# Altium schematic sheet A3210.SchDoc
size A4
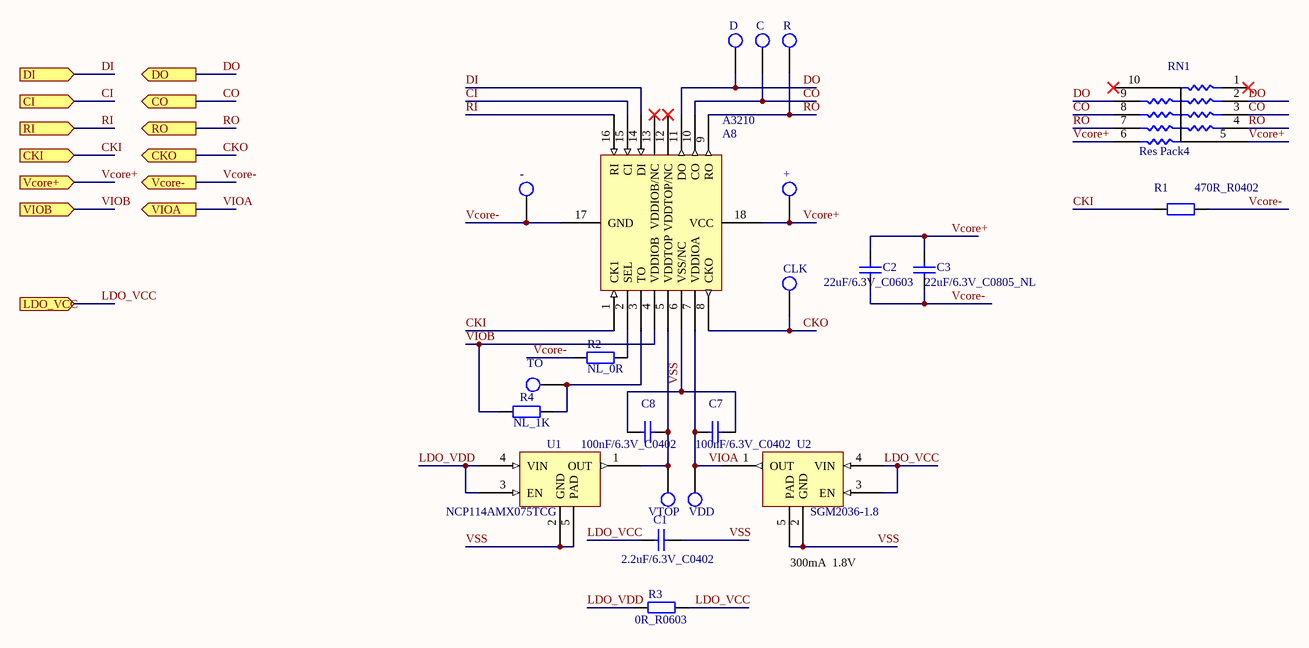
[diagram p0: A3210.SchDoc]

## Parts
+  Socket  [tp28]  (value not drawn)
-  Socket  [tp28]  (value not drawn)
A8  A3210  [DFN-A8-007]
C  Socket  [tp28]  (value not drawn)
C1  value 2.2uF/6.3V_C0402  [c0402]  (hidden comment: Cap)
C2  value 22uF/6.3V_C0603  [c0603]  (hidden comment: Cap)
C3  value 22uF/6.3V_C0805_NL  [c0805]  (hidden comment: Cap)
C7  value 100nF/6.3V_C0402  [c0402]  (hidden comment: Cap)
C8  value 100nF/6.3V_C0402  [c0402]  (hidden comment: Cap)
CLK  Socket  [tp28]  (value not drawn)
D  Socket  [tp28]  (value not drawn)
R  Socket  [tp28]  (value not drawn)
R1  value 470R_R0402  [r0402]  (hidden comment: Res2)
R2  value NL_0R  [R0603]  (hidden comment: Res2)
R3  value 0R_R0603  [R0603]  (hidden comment: Res2)
R4  value NL_1K  [R0402]  (hidden comment: Res2)
RN1  Res Pack4  [RN0402-8-a]
TO  Socket  [tp28]  (value not drawn)
U1  NCP114AMX075TCG  [DFN4-065-0101-006-N]
U2  SGM2036-1.8  [DFN4-065-0101-006-N]
VDD  Socket  [tp28]  (value not drawn)
VTOP  Socket  [tp28]  (value not drawn)

## Ports
CI (in), CKI (in), CKO (out), CO (out), DI (in), DO (out), LDO_VCC (in), RI (in), RO (out), Vcore+ (in), Vcore- (out), VIOA (out), VIOB (in)

## Nets
CI: A8.15(CI) ; port CI
CKI: A8.1(CK1) R1.2 ; port CKI
CKO: A8.8(CKO) CLK.1 ; port CKO
CO: A8.10(CO) C.1 RN1.3 RN1.8 ; port CO
DI: A8.14(DI) ; port DI
DO: A8.11(DO) D.1 RN1.2 RN1.9 ; port DO
LDO_VCC: C1.1 R3.1 U2.3(EN) U2.4(VIN) ; port LDO_VCC
LDO_VDD: R3.2 U1.3(EN) U1.4(VIN)
RI: A8.16(RI) ; port RI
RO: A8.9(RO) R.1 RN1.4 RN1.7 ; port RO
Vcore+: +.1 A8.18(VCC) C2.1 C3.1 RN1.5 RN1.6 ; port Vcore+
Vcore-: -.1 A8.17(GND) C2.2 C3.2 R1.1 R2.2 ; port Vcore-
VIOA: A8.7(VDDIOA) C7.1 U2.1(OUT) VDD.1 ; port VIOA
VIOB: A8.4(VDDIOB) R4.1 ; port VIOB
VSS: A8.6(VSS/NC) C1.2 C7.2 C8.1 U1.2(GND) U1.5(PAD) U2.2(GND) U2.5(PAD)
NetA8_2: A8.2(SEL) R2.1
NetA8_3: A8.3(TO) R4.2 TO.1
NetA8_5: A8.5(VDDTOP) C8.2 U1.1(OUT) VTOP.1

Not connected (* = marked no-connect by the designer): A8 12(VDDTOP/NC)* 13(VDDIOB/NC)*; RN1 1* 10*

## Notes on the sheet
- (near U2) 300mA  1.8V

## Library data of the parts
+ - C CLK D R TO VDD VTOP = Socket: TP; LatestRevisionDate: 17-Jul-2002; LatestRevisionNote: Re-released for DXP Platform.; Publisher: Altium Limited
A8 U1 U2 = Component_1
C1-C3 C7 C8 = Cap: Capacitor; Published: 8-Jun-2000; LatestRevisionDate: 17-Jul-2002; LatestRevisionNote: Re-released for DXP Platform.; PackageReference: RAD-0.3; Publisher: Altium Limited
R1-R4 = Res2: Resistor; Published: 8-Jun-2000; LatestRevisionDate: 17-Jul-2002; LatestRevisionNote: Re-released for DXP Platform.; PackageReference: AXIAL-0.4; Publisher: Altium Limited
RN1 = Res Pack4: YC158; Published: 24-Mar-1999; LatestRevisionDate: 29-May-2009; LatestRevisionNote: IPC-7351 Footprint Added.; PackageReference: SO-16; Publisher: Altium Limited; PackageDescription: 16-Pin Small Outline Integrated Circuit 1.27 mm Pitch; Code_JEDEC: MS-012-AC; Code_IPC: SOIC127P600-16